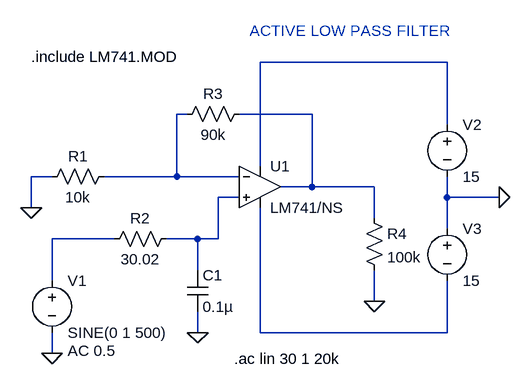
[diagram p0: schematic Active LPF.asc]
Active LPF.asc, the LTspice schematic file:
Version 4
SHEET 1 880 680
WIRE 448 -144 160 -144
WIRE 48 -64 32 -64
WIRE 240 -64 128 -64
WIRE 448 -48 448 -144
WIRE 160 16 160 -144
WIRE -160 32 -192 32
WIRE 32 32 32 -64
WIRE 32 32 -80 32
WIRE 128 32 32 32
WIRE 240 48 240 -64
WIRE 240 48 192 48
WIRE 336 48 240 48
WIRE 128 64 96 64
WIRE 448 64 448 32
WIRE 528 64 448 64
WIRE -192 80 -192 32
WIRE 336 96 336 48
WIRE 448 112 448 64
WIRE -64 128 -160 128
WIRE 64 128 16 128
WIRE 96 128 96 64
WIRE 96 128 64 128
WIRE 64 176 64 128
WIRE -160 192 -160 128
WIRE 336 224 336 176
WIRE 64 272 64 240
WIRE 160 272 160 80
WIRE 448 272 448 192
WIRE 448 272 160 272
WIRE -160 304 -160 272
FLAG -192 80 0
FLAG 64 272 0
FLAG -160 304 0
FLAG 336 224 0
FLAG 528 64 0
SYMBOL voltage -160 176 R0
WINDOW 123 24 124 Left 2
WINDOW 39 0 0 Left 0
SYMATTR Value2 AC 0.5
SYMATTR InstName V1
SYMATTR Value SINE(0 1 500)
SYMBOL res -64 16 R90
WINDOW 0 0 56 VBottom 2
WINDOW 3 32 56 VTop 2
SYMATTR InstName R1
SYMATTR Value 10k
SYMBOL res 32 112 R90
WINDOW 0 0 56 VBottom 2
WINDOW 3 32 56 VTop 2
SYMATTR InstName R2
SYMATTR Value 30.02
SYMBOL cap 48 176 R0
SYMATTR InstName C1
SYMATTR Value 0.1µ
SYMBOL res 144 -80 R90
WINDOW 0 0 56 VBottom 2
WINDOW 3 32 56 VTop 2
SYMATTR InstName R3
SYMATTR Value 90k
SYMBOL res 320 80 R0
SYMATTR InstName R4
SYMATTR Value 100k
SYMBOL OpAmps\\opamp2 160 -16 R0
SYMATTR InstName U1
SYMATTR Value LM741/NS
SYMBOL voltage 448 -64 R0
SYMATTR InstName V2
SYMATTR Value 15
SYMBOL voltage 448 96 R0
SYMATTR InstName V3
SYMATTR Value 15
TEXT 120 312 Left 2 !.ac lin 30 1 20k
TEXT -192 -152 Left 2 !.include LM741.MOD
TEXT 144 -192 Left 2 ;ACTIVE LOW PASS FILTER

The netlist it stands for:
* Active LPF.asc
V1 N005 0 SINE(0 1 500) AC 0.5
R1 N002 0 10k
R2 N004 N005 30.02
C1 N004 0 0.1µ
R3 N003 N002 90k
R4 N003 0 100k
XU1 N004 N002 N001 N006 N003 LM741/NS  ; pins In+ In- V+ V- OUT
V2 N001 0 15
V3 0 N006 15
.ac lin 30 1 20k
.include LM741.MOD
* ACTIVE LOW PASS FILTER
.backanno
.end